# Altium schematic sheet 金属探测.SchDoc
size A4
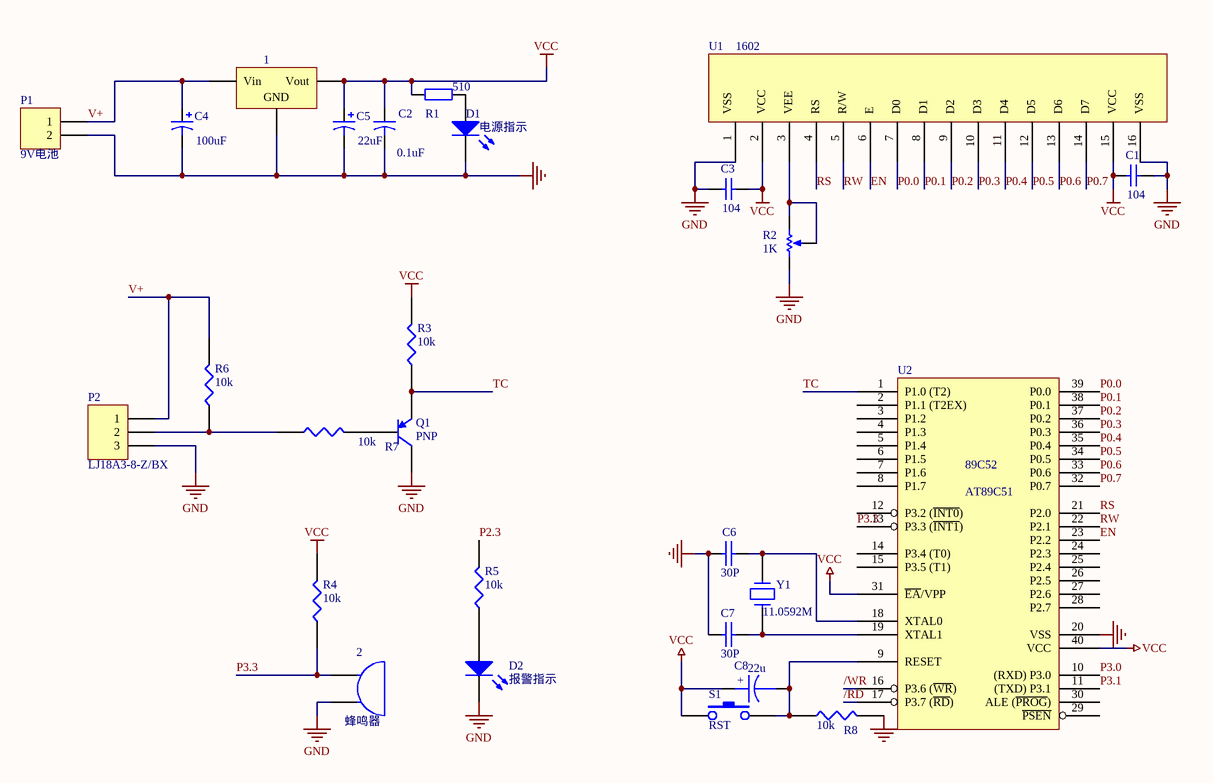
[diagram p0: 金属探测.SchDoc]

## Parts
1  (no value)  [SIP-G3/Y2]
2  蜂鸣器
C1  value 104  [RAD-0.3]
C2  value 0.1uF  [CAPR5-4X5]
C3  value 104  [RAD-0.3]
C4  value 100uF  [CC2012-0805]
C5  value 22uF  [CC2012-0805]
C6  30P
C7  30P
C8  22u
D1  电源指示  [DSO-F2/D6.1]
D2  报警指示  [DSO-F2/D6.1]
P1  9V电池  [HDR1X2]
P2  LJ18A3-8-Z/BX  [HDR1X3]
Q1  PNP  [SOT-23B_N]
R1  value 510  [AXIAL-0.4]
R2  value 1K  [VR5]
R3  10k
R4  10k
R5  10k
R6  10k
R7  10k
R8  10k
S1  RST
U1  1602
U2  AT89C51
Y1  11.0592M

## Nets
GND: 1.2(GND) 2.2(B) C1.2 C2.2 C3.1 C4.2 C5.2 C6.1 C7.1 D1.2(K) D2.2(K) P1.2 P2.3 Q1.1(C) R2.1(TOP) R8.2 U1.1 U1.16 U2.20(VSS)
VCC: 1.3(Vout) C1.1 C2.1 C3.2 C5.1 C8.1 R1.2 R3.2 R4.2 S1.1 U1.2 U1.15 U2.31(~{EA}/VPP) U2.40(VCC)
/RD: U2.17(P3.7_(~{RD}))
/WR: U2.16(P3.6_(~{WR}))
EN: U1.6 U2.23(P2.2)
P0.0: U1.7 U2.39(P0.0)
P0.1: U1.8 U2.38(P0.1)
P0.2: U1.9 U2.37(P0.2)
P0.3: U1.10 U2.36(P0.3)
P0.4: U1.11 U2.35(P0.4)
P0.5: U1.12 U2.34(P0.5)
P0.6: U1.13 U2.33(P0.6)
P0.7: U1.14 U2.32(P0.7)
P2.3: R5.2
P3.0: U2.10((RXD)_P3.0)
P3.1: U2.11((TXD)_P3.1)
P3.3: 2.1(A) R4.1 U2.13(P3.3_(~{INT1}))
RS: U1.4 U2.21(P2.0)
RW: U1.5 U2.22(P2.1)
TC: Q1.3(E) R3.1 U2.1(P1.0_(T2))
V+: 1.1(Vin) C4.1 P1.1 P2.1 R6.2
NetC6_2: C6.2 U2.18(XTAL0) Y1.2
NetC7_2: C7.2 U2.19(XTAL1) Y1.1
NetC8_2: C8.2 R8.1 S1.2 U2.9(RESET)
NetD1_1: D1.1(A) R1.1
NetD2_1: D2.1(A) R5.1
NetP2_2: P2.2 R6.1 R7.1
NetQ1_2: Q1.2(B) R7.2
NetR2_2: R2.2(BOT) R2.3(TAP) U1.3

Not connected (* = marked no-connect by the designer): U2 2(P1.1_(T2EX)) 3(P1.2) 4(P1.3) 5(P1.4) 6(P1.5) 7(P1.6) 8(P1.7) 12(P3.2_(~{INT0})) 14(P3.4_(T0)) 15(P3.5_(T1)) 24(P2.3) 25(P2.4) 26(P2.5) 27(P2.6) 28(P2.7) 29(~{PSEN}) 30(ALE_(~{PROG}))

## Notes on the sheet
- (in symbol 1602) VSS; VCC; VEE; RS; R/W; E; D0; D1; D2; D3; D4; D5; D6; D7
- (in symbol CAPACITOR POL) +

## Library data of the parts
1 = Volt Reg: Voltage Regulator; Published: 24-Mar-1999; LatestRevisionDate: 17-Jul-2002; LatestRevisionNote: Re-released for DXP Platform.; Publisher: Altium Limited; Code_JEDEC: SMD-220
2 = BUZZER
C1 C3 = Cap: Capacitor; Published: 8-Jun-2000; LatestRevisionDate: 17-Jul-2002; LatestRevisionNote: Re-released for DXP Platform.; PackageReference: RAD-0.3; Publisher: Altium Limited
C2 = Cap2: Capacitor; Published: 23-Sep-2002; Publisher: Altium Limited
C4 C5 = Cap Pol3: Polarized Capacitor (Surface Mount); Published: 8-Jun-2000; LatestRevisionDate: 17-Jul-2002; LatestRevisionNote: Re-released for DXP Platform.; PackageReference: C0805; Publisher: Altium Limited
C6 C7 = CAP: Capacitor
C8 = CAPACITOR POL: Capacitor
D1 D2 = LED2: Typical RED, GREEN, YELLOW, AMBER GaAs LED; Published: 8-Jun-2000; LatestRevisionDate: 17-Jul-2002; LatestRevisionNote: Re-released for DXP Platform.; Publisher: Altium Limited
P1 = Header 2: Header, 2-Pin; LatestRevisionDate: 17-Jul-2002; LatestRevisionNote: Re-released for DXP Platform.; Publisher: Altium Limited
P2 = Header 3: Header, 3-Pin; LatestRevisionDate: 17-Jul-2002; LatestRevisionNote: Re-released for DXP Platform.; Publisher: Altium Limited
Q1 = PNP: PNP Bipolar Transistor; Published: 8-Jun-2000; LatestRevisionDate: 29-May-2009; LatestRevisionNote: IPC-7351 Footprint Added.; PackageVersion: Aug-1999; PackageReference: SOT-23B; Publisher: Altium Limited; PackageDescription: 3-Pin SOT-23 Package 0.95 mm Pitch, 2.4 mm Lead Span
R1 = Res2: Resistor; Published: 8-Jun-2000; LatestRevisionDate: 17-Jul-2002; LatestRevisionNote: Re-released for DXP Platform.; Publisher: Altium Limited
R2 = RPot: Potentiometer; Sim Note: Enter the Resistance value and the set point into parameter fields.; Set Position: 0.5; Published: 8-Jun-2000; LatestRevisionDate: 17-Jul-2002; LatestRevisionNote: Re-released for DXP Platform.; PackageReference: VR5; Publisher: Altium Limited
R3-R8 = RES1
S1 = SW-PB
U2 = 89C52
Y1 = CRYSTAL